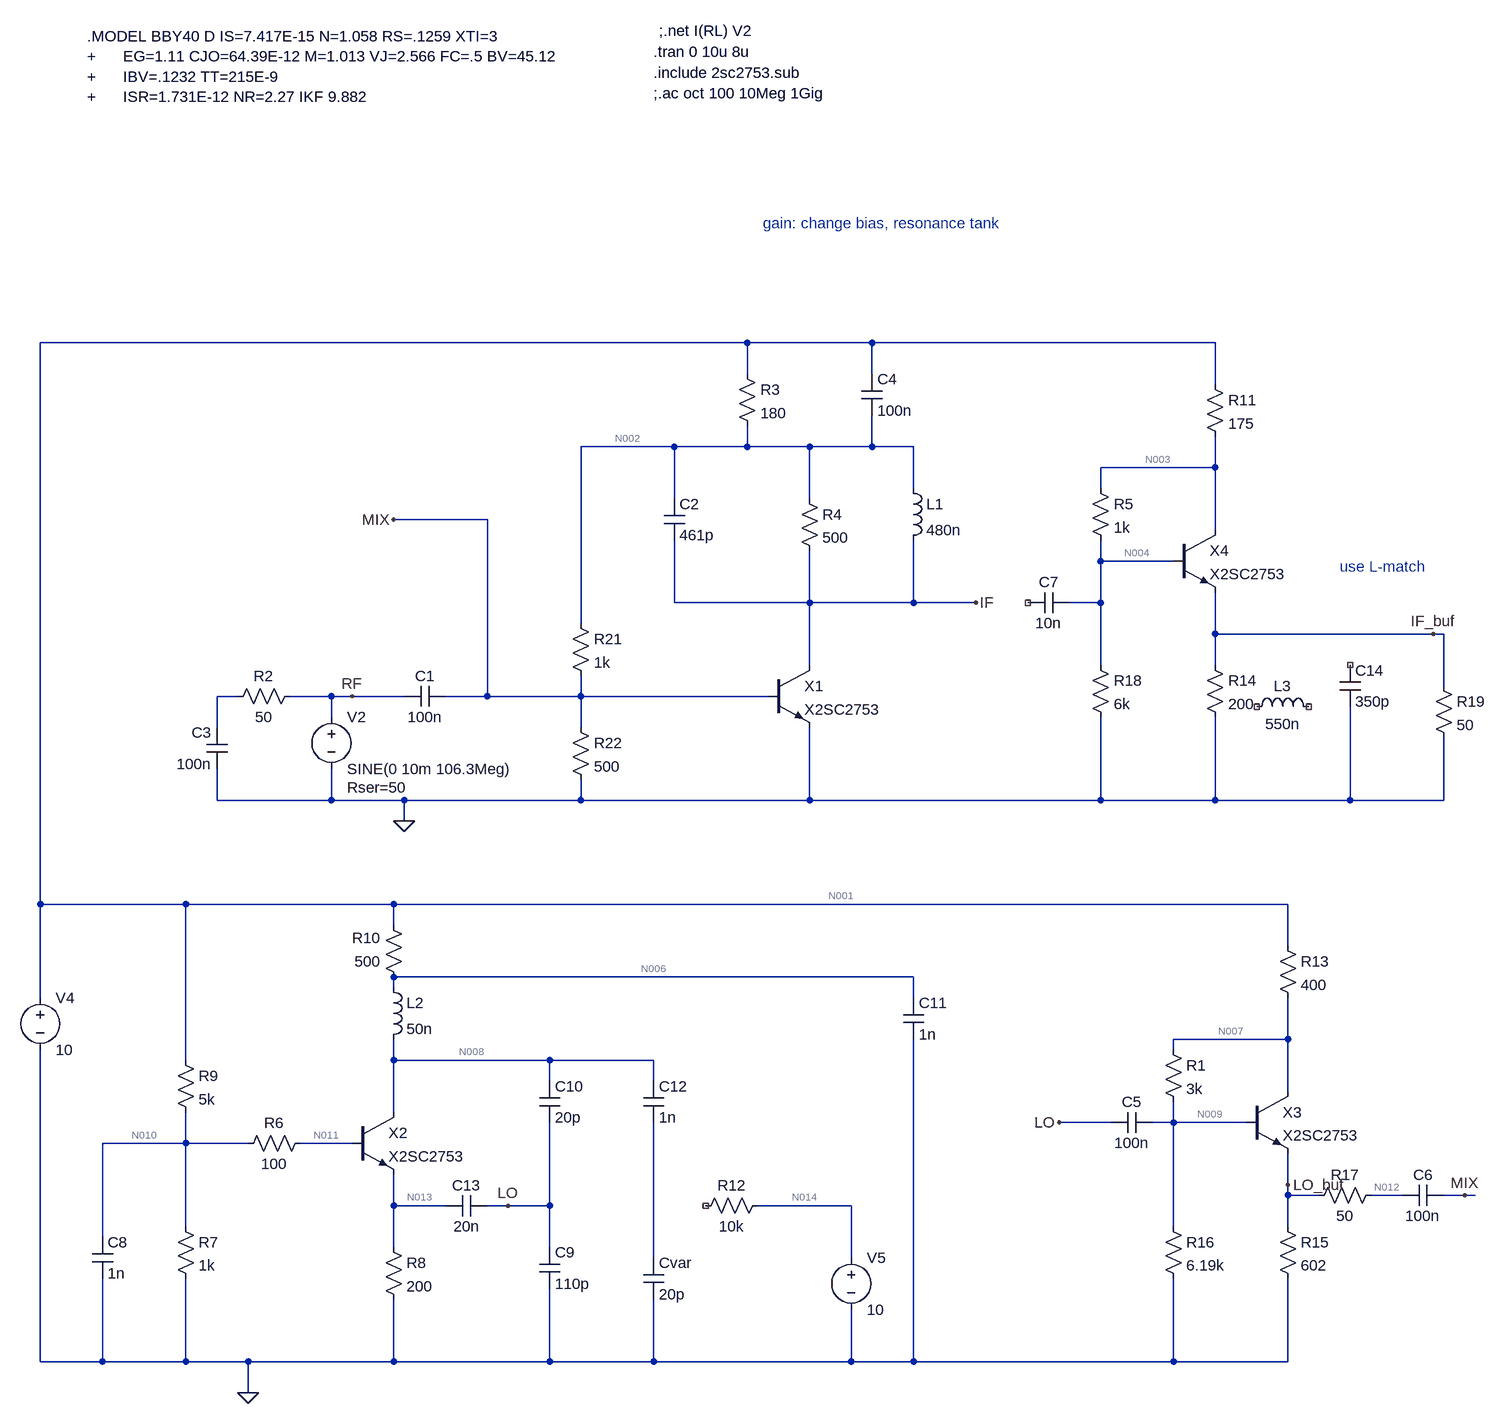
[diagram p0: schematic mixer-oscillator.asc]
mixer-oscillator.asc, the LTspice schematic file:
Version 4
SHEET 1 3924 2228
WIRE 656 -16 -432 -16
WIRE 848 -16 656 -16
WIRE 1376 -16 848 -16
WIRE 656 32 656 -16
WIRE 848 32 848 -16
WIRE 1376 48 1376 -16
WIRE 544 144 400 144
WIRE 656 144 656 112
WIRE 656 144 544 144
WIRE 752 144 656 144
WIRE 848 144 848 96
WIRE 848 144 752 144
WIRE 912 144 848 144
WIRE 1376 176 1376 128
WIRE 1376 176 1200 176
WIRE 912 208 912 144
WIRE 1200 208 1200 176
WIRE 544 224 544 144
WIRE 752 224 752 144
WIRE 256 256 112 256
WIRE 1376 272 1376 176
WIRE 1200 320 1200 288
WIRE 1312 320 1200 320
WIRE 544 384 544 288
WIRE 752 384 752 304
WIRE 752 384 544 384
WIRE 912 384 912 288
WIRE 912 384 752 384
WIRE 1008 384 912 384
WIRE 1200 384 1200 320
WIRE 1200 384 1152 384
WIRE 400 416 400 144
WIRE 1376 432 1376 368
WIRE 1712 432 1376 432
WIRE 1728 432 1712 432
WIRE 752 480 752 384
WIRE 1200 480 1200 384
WIRE 1376 480 1376 432
WIRE 1728 512 1728 432
WIRE -128 528 -160 528
WIRE 16 528 -48 528
WIRE 48 528 16 528
WIRE 128 528 48 528
WIRE 256 528 256 256
WIRE 256 528 192 528
WIRE 400 528 400 496
WIRE 400 528 256 528
WIRE 688 528 400 528
WIRE 16 560 16 528
WIRE -160 576 -160 528
WIRE 400 576 400 528
WIRE -160 688 -160 640
WIRE 16 688 16 640
WIRE 16 688 -160 688
WIRE 128 688 16 688
WIRE 400 688 400 656
WIRE 400 688 128 688
WIRE 752 688 752 576
WIRE 752 688 400 688
WIRE 1200 688 1200 560
WIRE 1200 688 752 688
WIRE 1376 688 1376 560
WIRE 1376 688 1200 688
WIRE 1584 688 1584 544
WIRE 1584 688 1376 688
WIRE 1728 688 1728 592
WIRE 1728 688 1584 688
WIRE 128 720 128 688
WIRE -432 848 -432 -16
WIRE -208 848 -432 848
WIRE 112 848 -208 848
WIRE 1488 848 112 848
WIRE 112 880 112 848
WIRE 1488 912 1488 848
WIRE 912 960 112 960
WIRE 112 976 112 960
WIRE -432 992 -432 848
WIRE 912 992 912 960
WIRE 1488 1056 1488 992
WIRE 1488 1056 1312 1056
WIRE 1312 1072 1312 1056
WIRE -208 1088 -208 848
WIRE 112 1088 112 1056
WIRE 352 1088 112 1088
WIRE 512 1088 352 1088
WIRE 352 1120 352 1088
WIRE 512 1120 512 1088
WIRE 1488 1136 1488 1056
WIRE 112 1168 112 1088
WIRE 1216 1184 1136 1184
WIRE 1312 1184 1312 1152
WIRE 1312 1184 1280 1184
WIRE 1424 1184 1312 1184
WIRE -208 1216 -208 1168
WIRE -208 1216 -336 1216
WIRE -112 1216 -208 1216
WIRE 48 1216 -32 1216
WIRE 1488 1280 1488 1232
WIRE 1488 1296 1488 1280
WIRE 1536 1296 1488 1296
WIRE 1664 1296 1616 1296
WIRE 1760 1296 1728 1296
WIRE 1776 1296 1760 1296
WIRE 112 1312 112 1264
WIRE 192 1312 112 1312
WIRE 288 1312 256 1312
WIRE 352 1312 352 1184
WIRE 352 1312 288 1312
WIRE 816 1312 672 1312
WIRE -208 1344 -208 1216
WIRE 1312 1344 1312 1184
WIRE 1488 1344 1488 1296
WIRE -336 1360 -336 1216
WIRE 112 1376 112 1312
WIRE 352 1376 352 1312
WIRE 512 1392 512 1184
WIRE 816 1392 816 1312
WIRE -432 1552 -432 1072
WIRE -336 1552 -336 1424
WIRE -336 1552 -432 1552
WIRE -208 1552 -208 1424
WIRE -208 1552 -336 1552
WIRE -112 1552 -208 1552
WIRE 112 1552 112 1456
WIRE 112 1552 -112 1552
WIRE 352 1552 352 1440
WIRE 352 1552 112 1552
WIRE 512 1552 512 1456
WIRE 512 1552 352 1552
WIRE 816 1552 816 1472
WIRE 816 1552 512 1552
WIRE 912 1552 912 1056
WIRE 912 1552 816 1552
WIRE 1312 1552 1312 1424
WIRE 1312 1552 912 1552
WIRE 1488 1552 1488 1424
WIRE 1488 1552 1312 1552
WIRE -112 1600 -112 1552
FLAG 128 720 0
FLAG -112 1600 0
FLAG 288 1312 LO
FLAG 1136 1184 LO
FLAG 1008 384 IF
FLAG 1712 432 IF_buf
FLAG 112 256 MIX
FLAG 1760 1296 MIX
FLAG 48 528 RF
FLAG 1488 1280 LO_buf
SYMBOL Cap 528 224 R0
SYMATTR InstName C2
SYMATTR Value 461p
SYMBOL ind 896 192 R0
SYMATTR InstName L1
SYMATTR Value 480n
SYMBOL Cap -144 640 R180
WINDOW 0 24 56 Left 2
WINDOW 3 24 8 Left 2
SYMATTR InstName C3
SYMATTR Value 100n
SYMBOL cap -352 1360 R0
SYMATTR InstName C8
SYMATTR Value 1n
SYMBOL res -224 1328 R0
SYMATTR InstName R7
SYMATTR Value 1k
SYMBOL res 96 1360 R0
SYMATTR InstName R8
SYMATTR Value 200
SYMBOL res -224 1072 R0
SYMATTR InstName R9
SYMATTR Value 5k
SYMBOL res 128 976 R180
WINDOW 0 36 76 Left 2
WINDOW 3 36 40 Left 2
SYMATTR InstName R10
SYMATTR Value 500
SYMBOL cap 336 1376 R0
SYMATTR InstName C9
SYMATTR Value 110p
SYMBOL cap 336 1120 R0
SYMATTR InstName C10
SYMATTR Value 20p
SYMBOL cap 896 992 R0
SYMATTR InstName C11
SYMATTR Value 1n
SYMBOL cap 496 1120 R0
SYMATTR InstName C12
SYMATTR Value 1n
SYMBOL ind 96 960 R0
SYMATTR InstName L2
SYMATTR Value 50n
SYMBOL npn 48 1168 R0
SYMATTR InstName X2
SYMATTR Value X2SC2753
SYMATTR Prefix X
SYMBOL voltage -432 976 R0
WINDOW 123 0 0 Left 0
WINDOW 39 0 0 Left 0
SYMATTR InstName V4
SYMATTR Value 10
SYMBOL res 688 1296 R90
WINDOW 0 0 56 VBottom 2
WINDOW 3 32 56 VTop 2
SYMATTR InstName R12
SYMATTR Value 10k
SYMBOL voltage 816 1376 R0
WINDOW 123 0 0 Left 0
WINDOW 39 0 0 Left 0
SYMATTR InstName V5
SYMATTR Value 10
SYMBOL res -16 1200 R90
WINDOW 0 0 56 VBottom 2
WINDOW 3 32 56 VTop 2
SYMATTR InstName R6
SYMATTR Value 100
SYMBOL cap 496 1392 R0
SYMATTR InstName Cvar
SYMATTR Value 20p
SYMBOL voltage 16 544 R0
WINDOW 123 0 0 Left 0
WINDOW 39 24 124 Left 2
SYMATTR InstName V2
SYMATTR Value SINE(0 10m 106.3Meg)
SYMATTR SpiceLine Rser=50
SYMBOL cap 256 1296 R90
WINDOW 0 0 32 VBottom 2
WINDOW 3 32 32 VTop 2
SYMATTR InstName C13
SYMATTR Value 20n
SYMBOL res 1296 1056 R0
SYMATTR InstName R1
SYMATTR Value 3k
SYMBOL res 1472 896 R0
SYMATTR InstName R13
SYMATTR Value 400
SYMBOL res 1472 1328 R0
SYMATTR InstName R15
SYMATTR Value 602
SYMBOL res 1296 1328 R0
SYMATTR InstName R16
SYMATTR Value 6.19k
SYMBOL cap 1280 1168 R90
WINDOW 0 0 32 VBottom 2
WINDOW 3 32 32 VTop 2
SYMATTR InstName C5
SYMATTR Value 100n
SYMBOL npn 1424 1136 R0
SYMATTR InstName X3
SYMATTR Value X2SC2753
SYMATTR Prefix X
SYMBOL res 1632 1280 R90
WINDOW 0 0 56 VBottom 2
WINDOW 3 32 56 VTop 2
SYMATTR InstName R17
SYMATTR Value 50
SYMBOL cap 1728 1280 R90
WINDOW 0 0 32 VBottom 2
WINDOW 3 32 32 VTop 2
SYMATTR InstName C6
SYMATTR Value 100n
SYMBOL npn 688 480 R0
SYMATTR InstName X1
SYMATTR Value X2SC2753
SYMATTR Prefix X
SYMBOL res -32 512 R90
WINDOW 0 0 56 VBottom 2
WINDOW 3 32 56 VTop 2
SYMATTR InstName R2
SYMATTR Value 50
SYMBOL cap 192 512 R90
WINDOW 0 0 32 VBottom 2
WINDOW 3 32 32 VTop 2
SYMATTR InstName C1
SYMATTR Value 100n
SYMBOL res 640 16 R0
SYMATTR InstName R3
SYMATTR Value 180
SYMBOL cap 832 32 R0
SYMATTR InstName C4
SYMATTR Value 100n
SYMBOL res 1184 192 R0
SYMATTR InstName R5
SYMATTR Value 1k
SYMBOL res 1360 32 R0
SYMATTR InstName R11
SYMATTR Value 175
SYMBOL res 1360 464 R0
SYMATTR InstName R14
SYMATTR Value 200
SYMBOL res 1184 464 R0
SYMATTR InstName R18
SYMATTR Value 6k
SYMBOL cap 1152 368 R90
WINDOW 0 0 32 VBottom 2
WINDOW 3 32 32 VTop 2
SYMATTR InstName C7
SYMATTR Value 10n
SYMBOL npn 1312 272 R0
SYMATTR InstName X4
SYMATTR Value X2SC2753
SYMATTR Prefix X
SYMBOL res 384 400 R0
SYMATTR InstName R21
SYMATTR Value 1k
SYMBOL res 384 560 R0
SYMATTR InstName R22
SYMATTR Value 500
SYMBOL res 736 208 R0
SYMATTR InstName R4
SYMATTR Value 500
SYMBOL ind 1424 560 R270
WINDOW 0 32 56 VTop 2
WINDOW 3 5 56 VBottom 2
SYMATTR InstName L3
SYMATTR Value 550n
SYMBOL cap 1568 480 R0
SYMATTR InstName C14
SYMATTR Value 350p
SYMBOL res 1712 496 R0
SYMATTR InstName R19
SYMATTR Value 50
TEXT 512 -464 Left 2 !.tran 0 10u 8u
TEXT 512 -432 Left 2 !.include 2sc2753.sub
TEXT -360 -488 Left 2 !.MODEL BBY40 D IS=7.417E-15 N=1.058 RS=.1259 XTI=3 \n+      EG=1.11 CJO=64.39E-12 M=1.013 VJ=2.566 FC=.5 BV=45.12 \n+      IBV=.1232 TT=215E-9\n+      ISR=1.731E-12 NR=2.27 IKF 9.882
TEXT 512 -400 Left 2 !;.ac oct 100 10Meg 1Gig
TEXT 520 -496 Left 2 !;.net I(RL) V2
TEXT 1568 328 Left 2 ;use L-match
TEXT 680 -200 Left 2 ;gain: change bias, resonance tank

The netlist it stands for:
* mixer-oscillator.asc
C2 N002 IF 461p
L1 N002 IF 480n
C3 0 N005 100n
C8 N010 0 1n
R7 N010 0 1k
R8 N013 0 200
R9 N001 N010 5k
R10 N006 N001 500
C9 LO 0 110p
C10 N008 LO 20p
C11 N006 0 1n
C12 N008 N015 1n
L2 N006 N008 50n
XX2 N008 N011 N013 X2SC2753  ; pins C B E
V4 N001 0 10
R12 N014 NC_01 10k
V5 N014 0 10
R6 N011 N010 100
Cvar N015 0 20p
V2 RF 0 SINE(0 10m 106.3Meg) Rser=50
C13 LO N013 20n
R1 N007 N009 3k
R13 N001 N007 400
R15 LO_buf 0 602
R16 N009 0 6.19k
C5 N009 LO 100n
XX3 N007 N009 LO_buf X2SC2753  ; pins C B E
R17 N012 LO_buf 50
C6 MIX N012 100n
XX1 IF MIX 0 X2SC2753  ; pins C B E
R2 RF N005 50
C1 MIX RF 100n
R3 N001 N002 180
C4 N001 N002 100n
R5 N003 N004 1k
R11 N001 N003 175
R14 IF_buf 0 200
R18 N004 0 6k
C7 N004 NC_02 10n
XX4 N003 N004 IF_buf X2SC2753  ; pins C B E
R21 N002 MIX 1k
R22 MIX 0 500
R4 N002 IF 500
L3 NC_03 NC_04 550n
C14 NC_05 0 350p
R19 IF_buf 0 50
.tran 0 10u 8u
.include 2sc2753.sub
.MODEL BBY40 D IS=7.417E-15 N=1.058 RS=.1259 XTI=3
+      EG=1.11 CJO=64.39E-12 M=1.013 VJ=2.566 FC=.5 BV=45.12
+      IBV=.1232 TT=215E-9
+      ISR=1.731E-12 NR=2.27 IKF 9.882
;.ac oct 100 10Meg 1Gig
;.net I(RL) V2
* use L-match
* gain: change bias, resonance tank
.backanno
.end

* Results of the author's LTspice run, read from the files saved beside the schematic
* Operating Point, zero values left out:
*   V(n002) = 3.116 V
*   V(if) = 3.116 V
*   V(n010) = 1.621 V
*   V(n013) = 811.6 mV
*   V(n001) = 10 V
*   V(n006) = 7.998 V
*   V(lo) = 480.5 nV
*   V(n008) = 7.998 V
*   V(n011) = 1.615 V
*   V(n014) = 10 V
*   V(n007) = 7.16 V
*   V(n009) = 4.641 V
*   V(lo_buf) = 3.823 V
*   V(n012) = 3.823 V
*   V(mix) = 867.5 mV
*   V(n003) = 3.322 V
*   V(n004) = 2.38 V
*   V(if_buf) = 1.51 V
*   I(L2) = 4.003 mA
*   I(L1) = 36 mA
*   I(R19) = 30.21 mA
*   I(R4) = 72 nA
*   I(R22) = 1.735 mA
*   I(R21) = 2.248 mA
*   I(R18) = 396.6 µA
*   I(R14) = 7.552 mA
*   I(R11) = 38.16 mA
*   I(R5) = 942.4 µA
*   I(R3) = 38.25 mA
*   I(R16) = 749.8 µA
*   I(R15) = 6.351 mA
*   I(R13) = 7.101 mA
*   I(R1) = 839.5 µA
*   I(R6) = -54.87 µA
*   I(R10) = -4.003 mA
*   I(R9) = 1.676 mA
*   I(R8) = 4.058 mA
*   I(R7) = 1.621 mA
*   I(V4) = -89.19 mA
*   Ix(x2:C1) = 4.003 mA
*   Ix(x2:B1) = 54.87 µA
*   Ix(x2:E1) = -4.058 mA
*   Ix(x3:C1) = 6.261 mA
*   Ix(x3:B1) = 89.77 µA
*   Ix(x3:E1) = -6.351 mA
*   Ix(x1:C1) = 36 mA
*   Ix(x1:B1) = 513.2 µA
*   Ix(x1:E1) = -36.51 mA
*   Ix(x4:C1) = 37.22 mA
*   Ix(x4:B1) = 545.7 µA
*   Ix(x4:E1) = -37.76 mA